# EAGLE design MJ514 - rev.1 - POC (EAGLE 9.6.2)
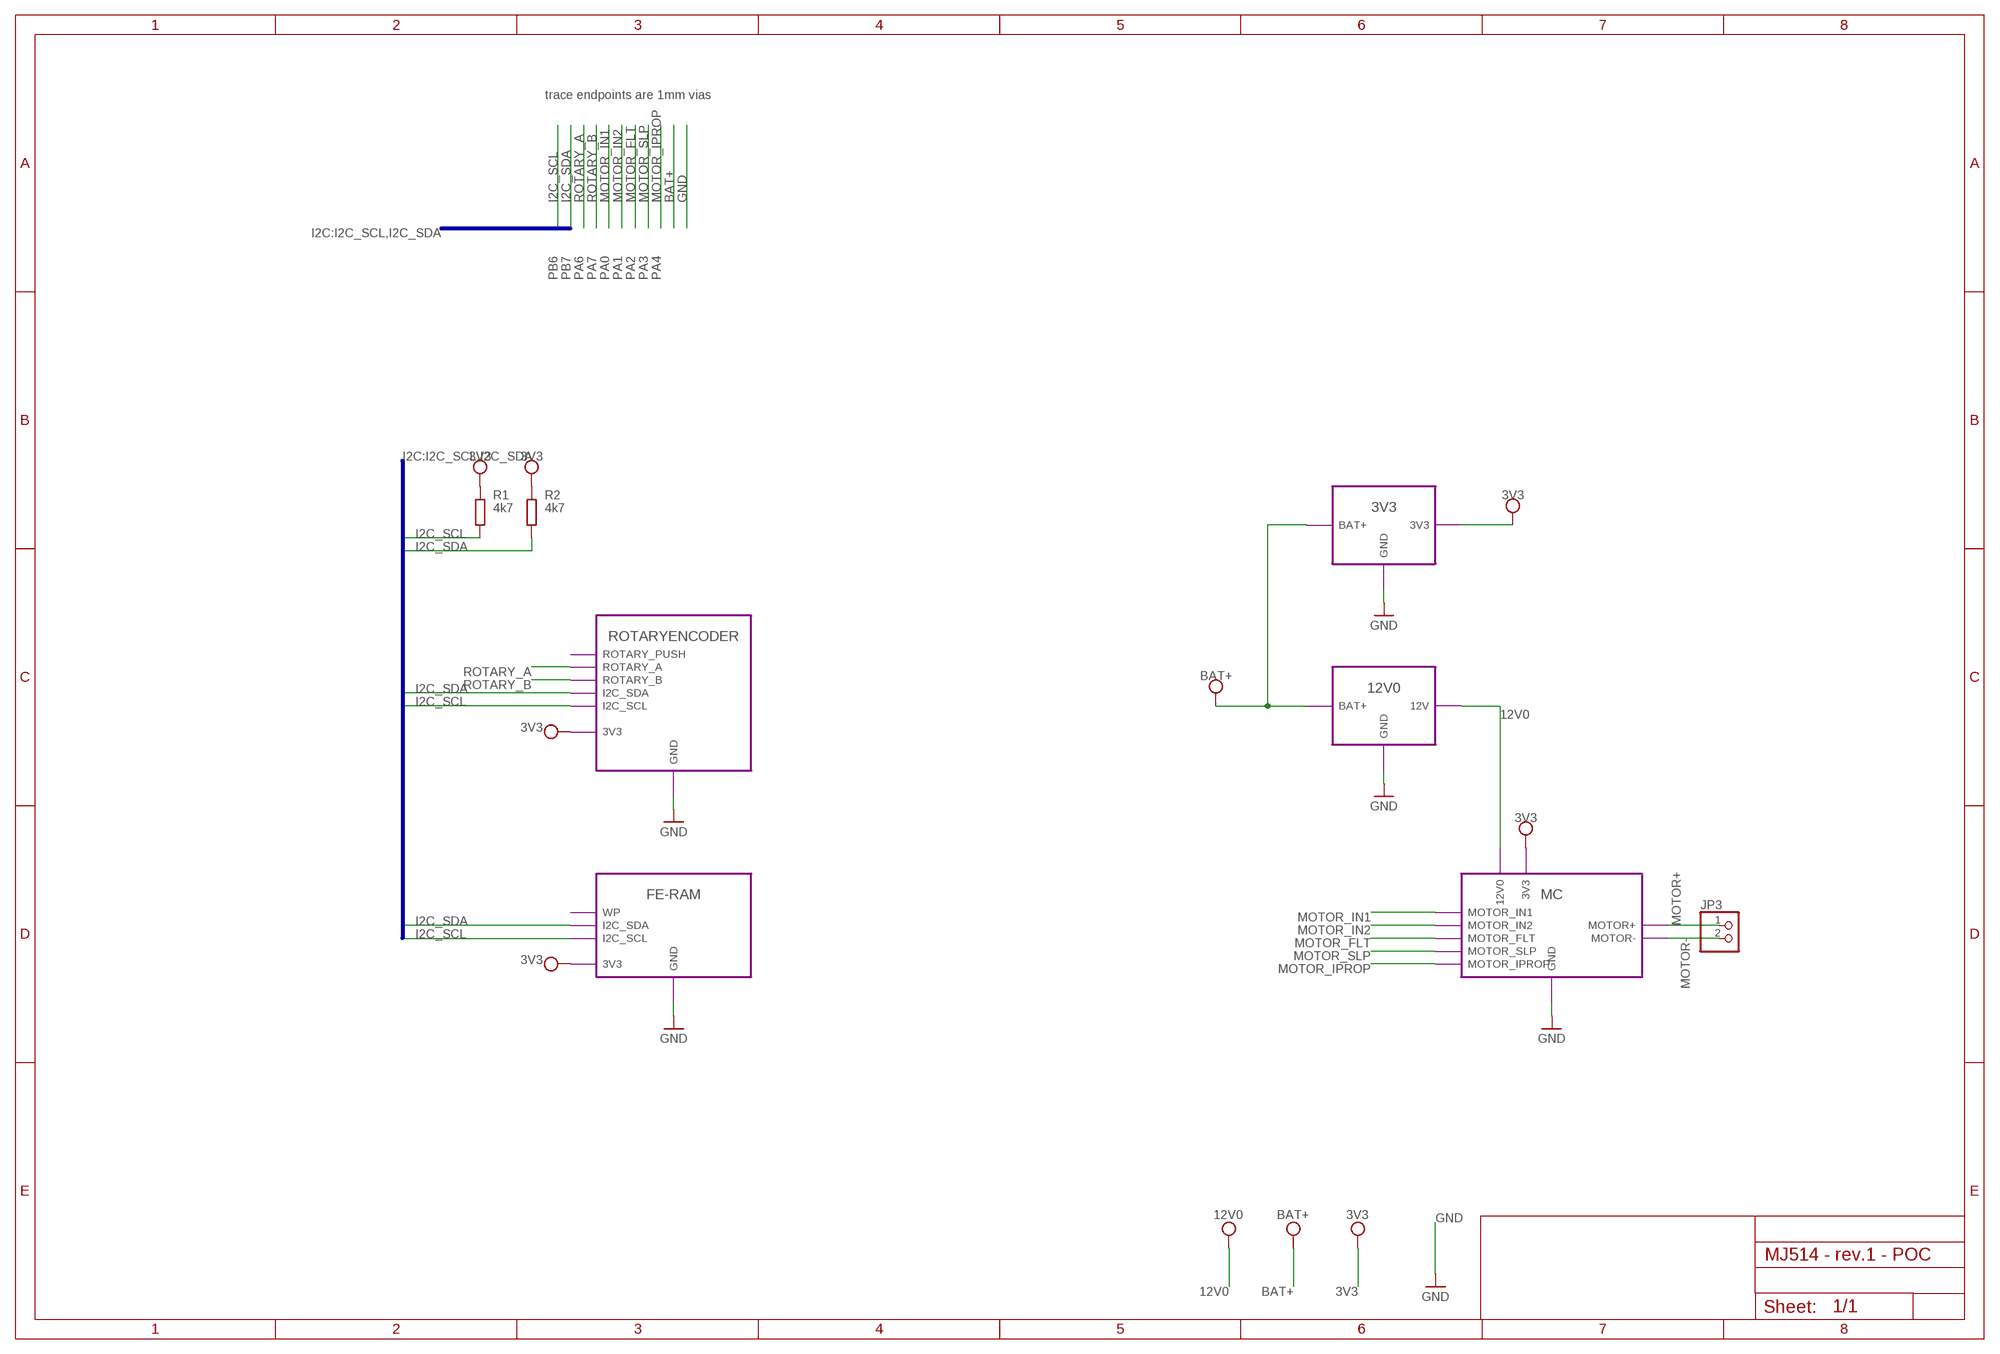
[diagram p0: schematic, sheet 1]

## Parts
JP3  PINHD-1X2  [1X02]
R1  4k7  R-EU_R0402  [R0402]
R2  4k7  R-EU_R0402  [R0402]

## Module instances
ROTARYENCODER = ROTARYENCODER (part numbers offset by 900)
FE-RAM = FE-RAM (part numbers offset by 700)
12V0 = 12V0 (part numbers offset by 800)
MC = MOTOR_CONTROLLER (part numbers offset by 1000)
3V3 = 3V3 (part numbers offset by 200)

## Nets
3V3 [3V3]: R1.2 R2.2 ; port ROTARYENCODER.3V3 FE-RAM.3V3 MC.3V3 3V3.3V3
12V0 [12V0]: port 12V0.12V MC.12V0
BAT+ [BAT+]: port 12V0.BAT+ 3V3.BAT+
GND: port FE-RAM.GND ROTARYENCODER.GND 12V0.GND MC.GND 3V3.GND
I2C_SCL [signal]: R1.1 ; port FE-RAM.I2C_SCL ROTARYENCODER.I2C_SCL
I2C_SDA [signal]: R2.1 ; port FE-RAM.I2C_SDA ROTARYENCODER.I2C_SDA
MOTOR+ [signal]: JP3.1 ; port MC.MOTOR+
MOTOR- [signal]: JP3.2 ; port MC.MOTOR-
MOTOR_FLT [signal]: port MC.MOTOR_FLT
MOTOR_IN1 [signal]: port MC.MOTOR_IN1
MOTOR_IN2 [signal]: port MC.MOTOR_IN2
MOTOR_IPROP [signal]: port MC.MOTOR_IPROP
MOTOR_SLP [signal]: port MC.MOTOR_SLP
ROTARY_A [signal]: port ROTARYENCODER.ROTARY_A
ROTARY_B [signal]: port ROTARYENCODER.ROTARY_B

## Buses
I2C:I2C_SCL,I2C_SDA

## Notes on the sheet
- trace endpoints are 1mm vias
- PB6 | PB7 | PA6 | PA7 | PA0 | PA1 | PA2 | PA3 | PA4

## Library data of the parts
JP3 = pinhead:PINHD-1X2: PIN HEADER
R1 R2 = rcl:R-EU_: RESISTOR, European symbol; SPICEPREFIX: R

## Module ROTARYENCODER
Ports: GND(pwr) 3V3(pwr) I2C_SCL(in) I2C_SDA(io) ROTARY_B(out) ROTARY_A(out) ROTARY_PUSH(out)
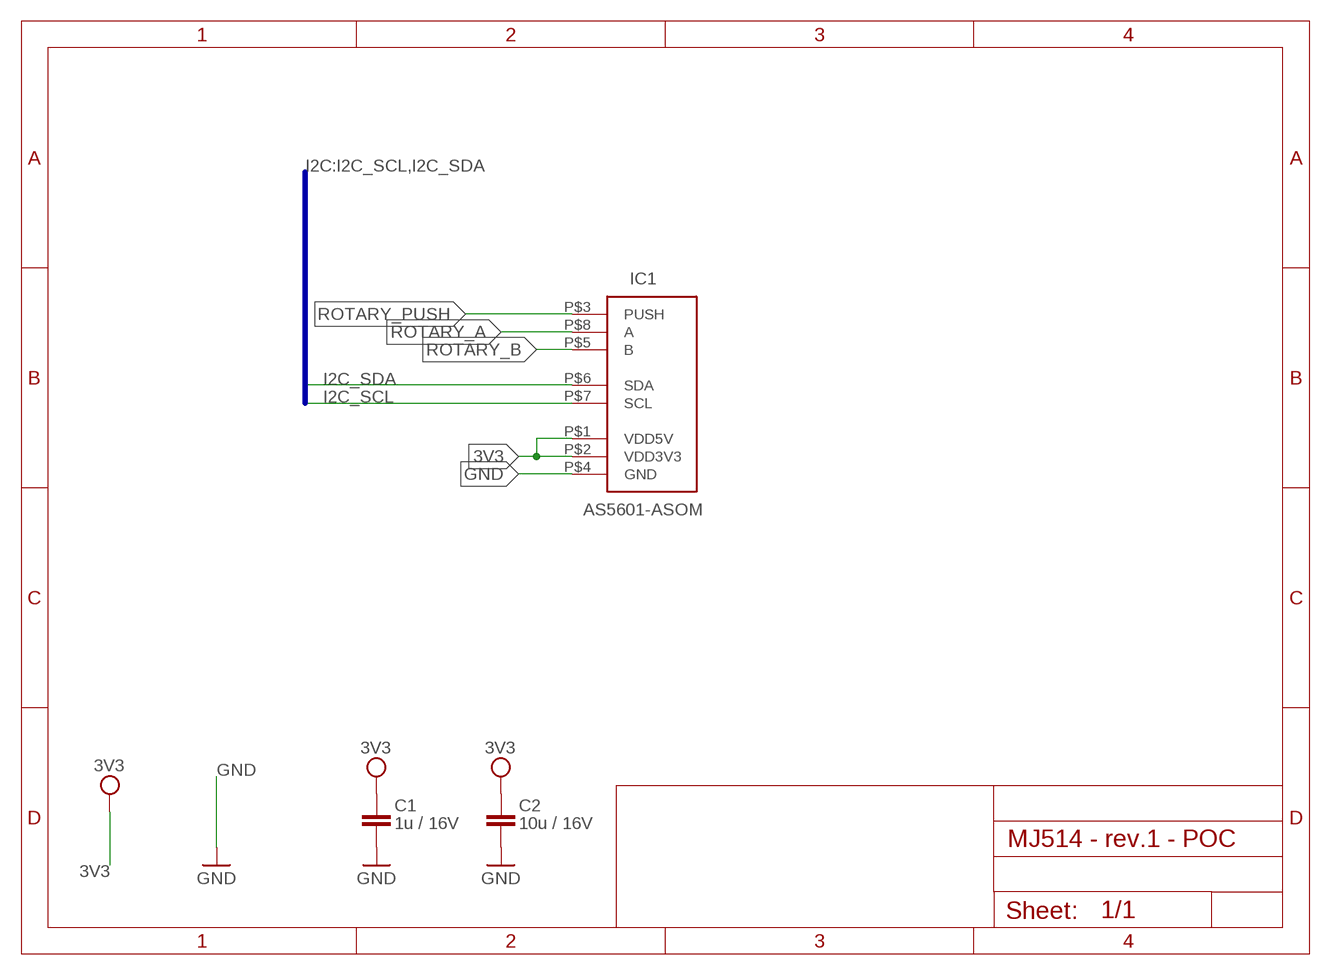
[diagram p1: schematic, module ROTARYENCODER, sheet 1]

### Parts
C1  1u / 16V  C-EUC0402  [C0402]
C2  10u / 16V  C-EUC0402  [C0402]
IC1  AS5601-ASOM  AS5601  [SOIC8]

### Nets
3V3: C1.1 C2.1 IC1.P$1(VDD5V) IC1.P$2(VDD3V3)
GND: C1.2 C2.2 IC1.P$4(GND)
I2C_SCL: IC1.P$7(SCL)
I2C_SDA: IC1.P$6(SDA)
ROTARY_A: IC1.P$8(A)
ROTARY_B: IC1.P$5(B)
ROTARY_PUSH: IC1.P$3(PUSH)

### Buses
I2C:I2C_SCL,I2C_SDA

### Library data of the parts
C1 C2 = rcl:C-EU: CAPACITOR, European symbol; SPICEPREFIX: C
IC1 = AS5601 - Programmable Contactless Encoder:AS5601

## Module FE-RAM
Ports: GND(pwr) 3V3(pwr) I2C_SCL(in) I2C_SDA(io) WP(hiz)
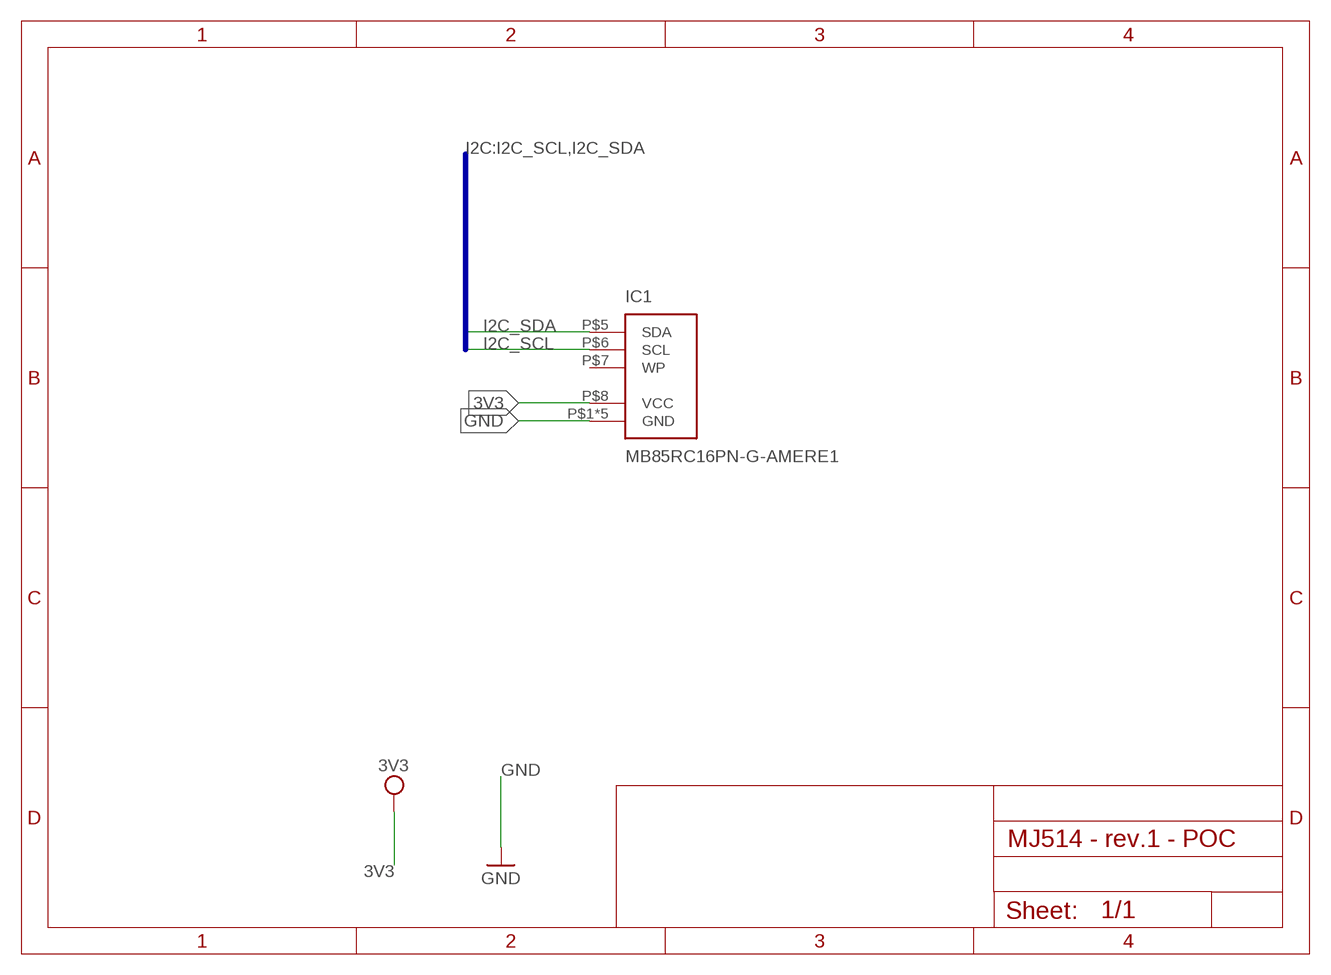
[diagram p2: schematic, module FE-RAM, sheet 1]

### Parts
IC1  MB85RC16PN-G-AMERE1  MB85RC  [SON-8]

### Nets
3V3: IC1.P$8(VCC)
GND: IC1.P$1(GND) IC1.P$2(GND) IC1.P$3(GND) IC1.P$4(GND) IC1.P$9(GND)
I2C_SCL: IC1.P$6(SCL)
I2C_SDA: IC1.P$5(SDA)
Unconnected: IC1.P$7(WP)

### Buses
I2C:I2C_SCL,I2C_SDA

### Library data of the parts
IC1 = MB85RC - FeRAM, I2C:MB85RC

## Module 12V0
Ports: GND(pwr) 12V(pwr) BAT+(pwr)
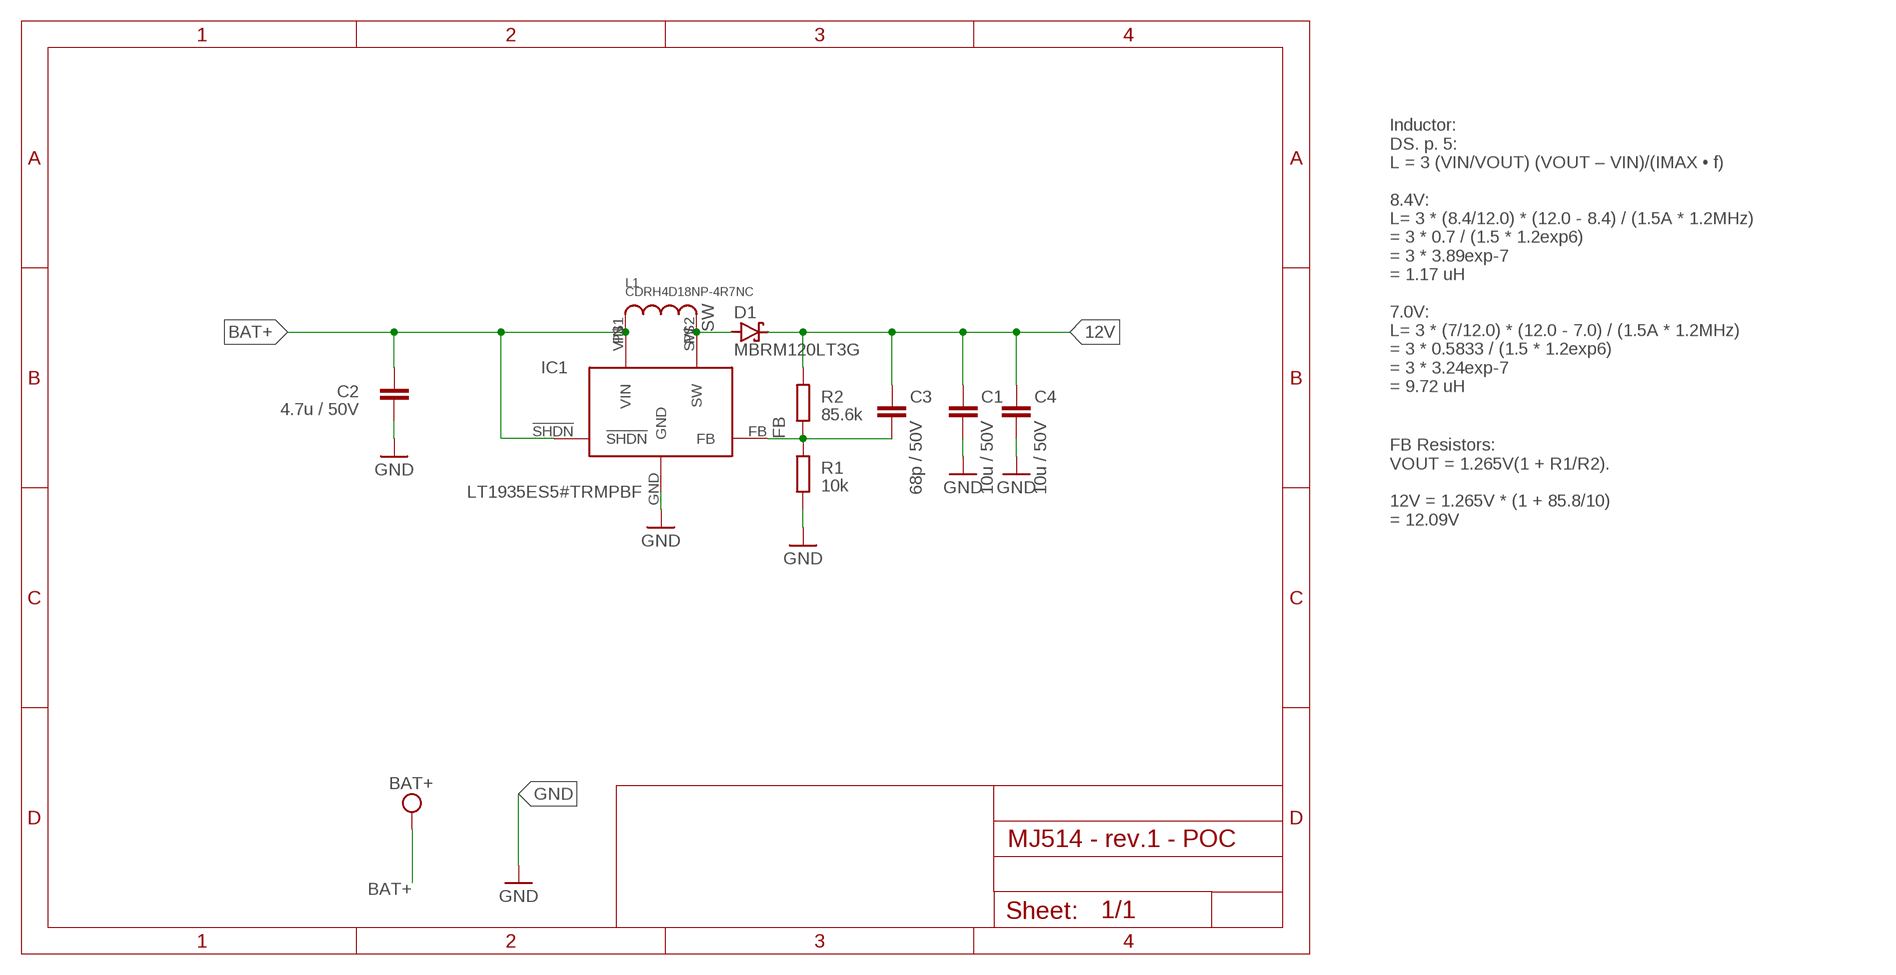
[diagram p3: schematic, module 12V0, sheet 1]

### Parts
C1  10u / 50V  C-EUC0402  [C0402]
C2  4.7u / 50V  C-EUC0805  [C0805]
C3  68p / 50V  C-EUC0402  [C0402]
C4  10u / 50V  C-EUC0402  [C0402]
D1  MBRM120LT3G  SCHOTTKY-DIODESMD  [SMB]
IC1  LT1935ES5#TRMPBF  LT1935  [TSOT-23-5]
L1  CDRH4D18NP-4R7NC  CDRH4D18  [5050]
R1  10k  R-EU_R0603  [R0603]
R2  85.6k  R-EU_R0603  [R0603]

### Nets
12V [12V0]: C1.1 C3.1 C4.1 D1.C R2.2
BAT+ [BAT+]: C2.2 IC1.!SHDN! IC1.VIN L1.P$1
FB [signal]: C3.2 IC1.FB R1.2 R2.1
GND: C1.2 C2.1 C4.2 IC1.GND R1.1
SW [12V0]: D1.A IC1.SW L1.P$2

### Notes on the sheet
- Inductor:
  DS. p. 5:
  L = 3 (VIN/VOUT) (VOUT – VIN)/(IMAX • f)
  
  8.4V:
  L= 3 * (8.4/12.0) * (12.0 - 8.4) / (1.5A * 1.2MHz)
  = 3 * 0.7 / (1.5 * 1.2exp6)
  = 3 * 3.89exp-7
  = 1.17 uH
  
  7.0V:
  L= 3 * (7/12.0) * (12.0 - 7.0) / (1.5A * 1.2MHz)
  = 3 * 0.5833 / (1.5 * 1.2exp6)
  = 3 * 3.24exp-7
  = 9.72 uH
- FB Resistors:
  VOUT = 1.265V(1 + R1/R2).
  
  12V = 1.265V * (1 + 85.8/10)
  = 12.09V

### Library data of the parts
C1-C4 = rcl:C-EU: CAPACITOR, European symbol; SPICEPREFIX: C
D1 = diode:SCHOTTKY-DIODE: Schottky Diode
IC1 = LTC1935 - Boost DC-DC Converter:LT1935
L1 = CDRH4D18 - Power Inductor:CDRH4D18
R1 R2 = rcl:R-EU_: RESISTOR, European symbol; SPICEPREFIX: R

## Module MOTOR_CONTROLLER
Ports: MOTOR+(out) MOTOR-(out) GND(pwr) 12V0(pwr) 3V3(pwr) MOTOR_IN1(in) MOTOR_IN2(in) MOTOR_FLT(out) MOTOR_SLP(in) MOTOR_IPROP(out)
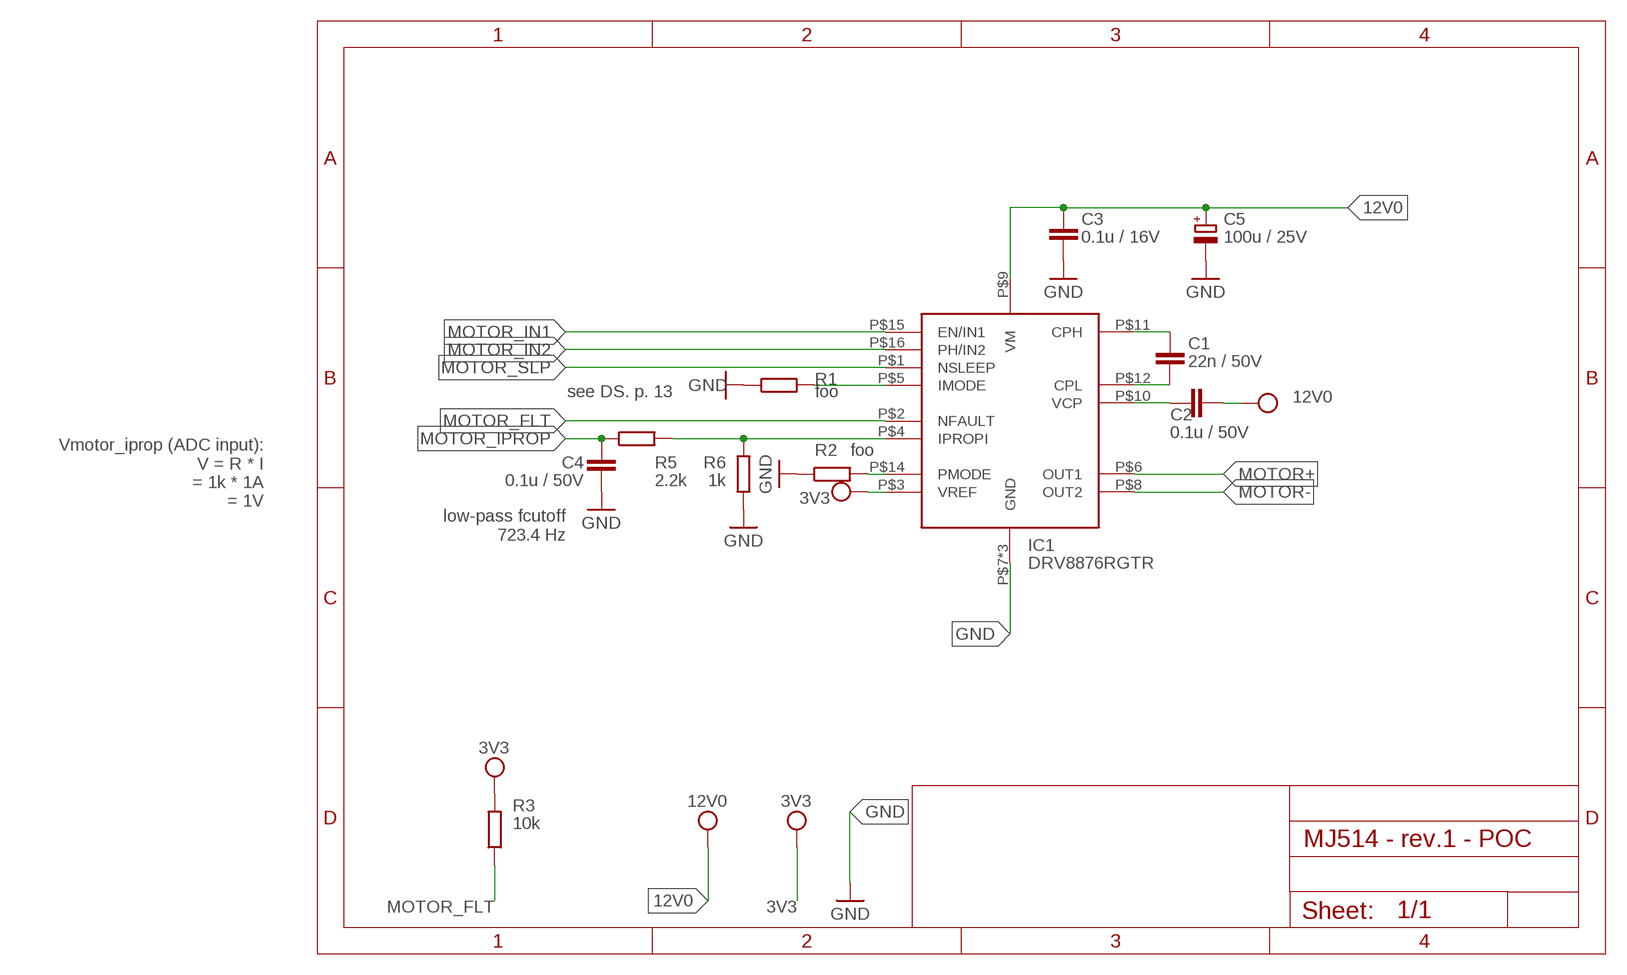
[diagram p4: schematic, module MOTOR_CONTROLLER, sheet 1]

### Parts
C1  22n / 50V  C-EUC0402  [C0402]
C2  0.1u / 50V  C-EUC0402  [C0402]
C3  0.1u / 16V  C-EUC0402  [C0402]
C4  0.1u / 50V  C-EUC0402  [C0402]
C5  100u / 25V  CPOL-EUE2.5-4V  [E2,5RE]
IC1  DRV8876RGTR  DRV8876  [VQFN16]
R1  foo  R-EU_R0402  [R0402]
R2  foo  R-EU_R0402  [R0402]
R3  10k  R-EU_R0402  [R0402]
R5  2.2k  R-EU_R0402  [R0402]
R6  1k  R-EU_R0402  [R0402]

### Nets
3V3 [signal]: IC1.P$3(VREF) R3.2
12V0 [12V0]: C2.2 C3.2 C5.+ IC1.P$9(VM)
CPH [signal]: C1.1 IC1.P$11(CPH)
CPL [signal]: C1.2 IC1.P$12(CPL)
GND: C3.1 C4.2 C5.- IC1.P$7(GND) IC1.P$13(GND) IC1.P$17(GND) R1.1 R2.1 R6.1
IMODE [signal]: IC1.P$5(IMODE) R1.2
IPROPI [signal]: IC1.P$4(IPROPI) R5.2 R6.2
MOTOR+ [signal]: IC1.P$6(OUT1)
MOTOR- [signal]: IC1.P$8(OUT2)
MOTOR_FLT [signal]: IC1.P$2(NFAULT) R3.1
MOTOR_IN1 [12V0]: IC1.P$15(EN/IN1)
MOTOR_IN2 [12V0]: IC1.P$16(PH/IN2)
MOTOR_IPROP [signal]: C4.1 R5.1
MOTOR_SLP [signal]: IC1.P$1(NSLEEP)
PMODE [signal]: IC1.P$14(PMODE) R2.2
VCP [signal]: C2.1 IC1.P$10(VCP)

### Notes on the sheet
- see DS. p. 13
- Vmotor_iprop (ADC input):
  V = R * I
  = 1k * 1A
  = 1V
- low-pass fcutoff
  723.4 Hz

### Library data of the parts
C1-C4 = rcl:C-EU: CAPACITOR, European symbol; SPICEPREFIX: C
C5 = rcl:CPOL-EU: POLARIZED CAPACITOR, European symbol; SPICEPREFIX: C
IC1 = DRV8876 - H-Bridge Motor Driver:DRV8876
R1-R3 R5 R6 = rcl:R-EU_: RESISTOR, European symbol; SPICEPREFIX: R

## Module 3V3
Ports: GND(pwr) BAT+(pwr) 3V3(pwr)
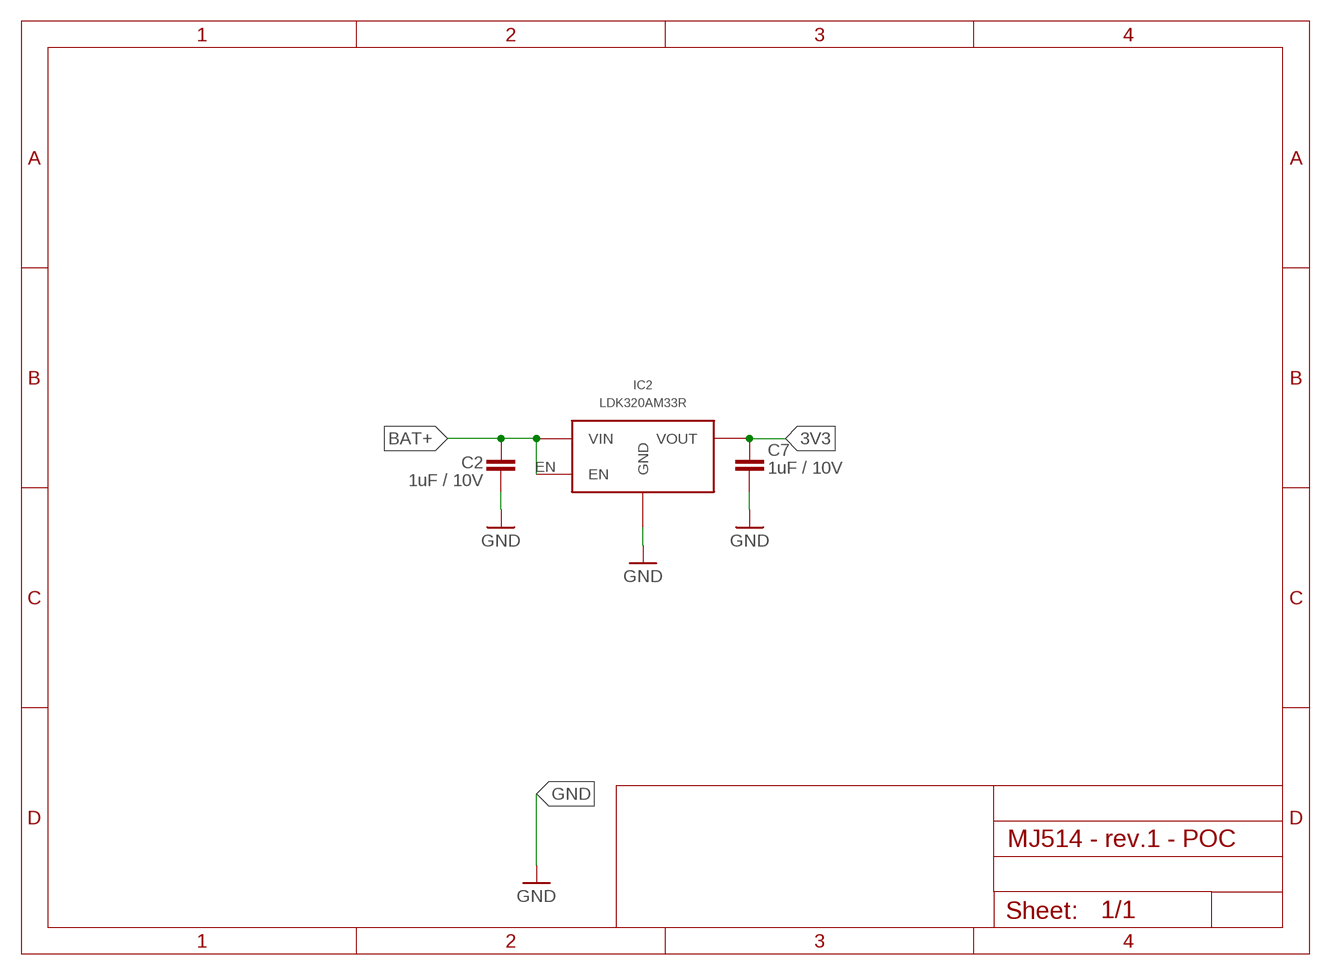
[diagram p5: schematic, module 3V3, sheet 1]

### Parts
C2  1uF / 10V  C-EUC0402  [C0402]
C7  1uF / 10V  C-EUC0402  [C0402]
IC2  LDK320AM33R  LDK320SOT-23-5L  [SOT-23-5L]

### Nets
3V3 [3V3]: C7.2 IC2.OUT(VOUT)
BAT+ [BAT+]: C2.1 IC2.EN IC2.IN(VIN)
GND: C2.2 C7.1 IC2.GND

### Library data of the parts
C2 C7 = rcl:C-EU: CAPACITOR, European symbol; SPICEPREFIX: C
IC2 = LDK320 5V LDO:LDK320

## Module HUMIDITY
Ports: GND(pwr) 3V3(pwr) SCL(in) SDA(io)
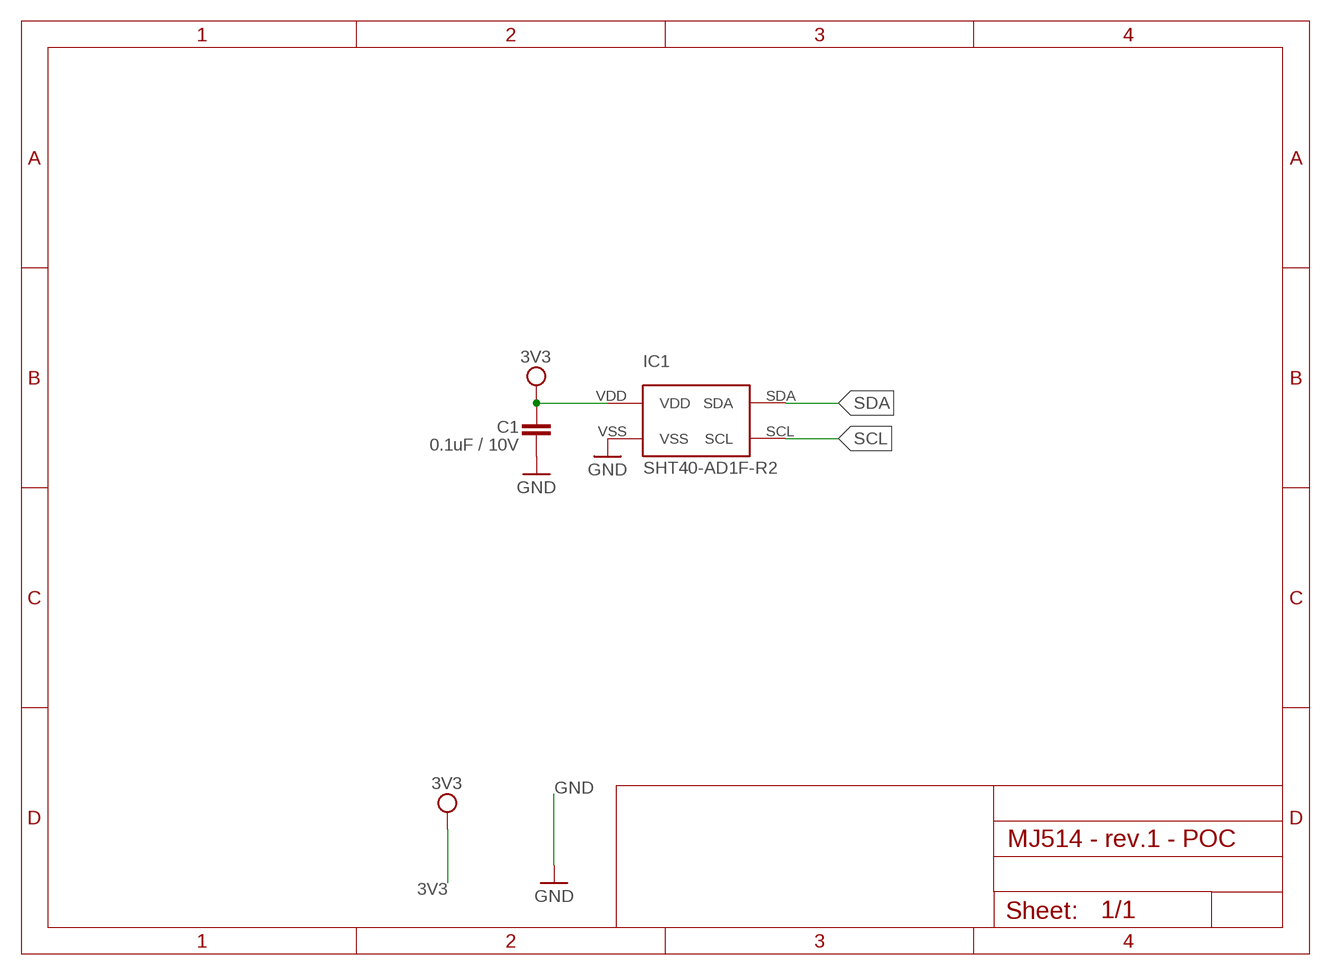
[diagram p6: schematic, module HUMIDITY, sheet 1]

### Parts
C1  0.1uF / 10V  C-EUC0402  [C0402]
IC1  SHT40-AD1F-R2  SHT40  [SMD]

### Nets
3V3 [3V3]: C1.1 IC1.VDD
GND: C1.2 IC1.VSS
SCL [signal]: IC1.SCL
SDA [signal]: IC1.SDA

### Library data of the parts
C1 = rcl:C-EU: CAPACITOR, European symbol; SPICEPREFIX: C
IC1 = SHT40-AD1F - Humidity Sensor:SHT40

## Net classes
0 GND: drill 0.35 mm, clearance 0.19 mm
1 BAT+: width 0.5 mm, drill 0.35 mm, clearance 0.19 mm
2 12V0: width 0.5 mm, drill 0.35 mm, clearance 0.19 mm
3 signal: width 0.25 mm, drill 0.35 mm, clearance 0.19 mm
4 3V3: width 0.25 mm, drill 0.35 mm, clearance 0.19 mm
5 motor: width 0.5 mm, drill 0.35 mm, clearance 0.19 mm

## Board
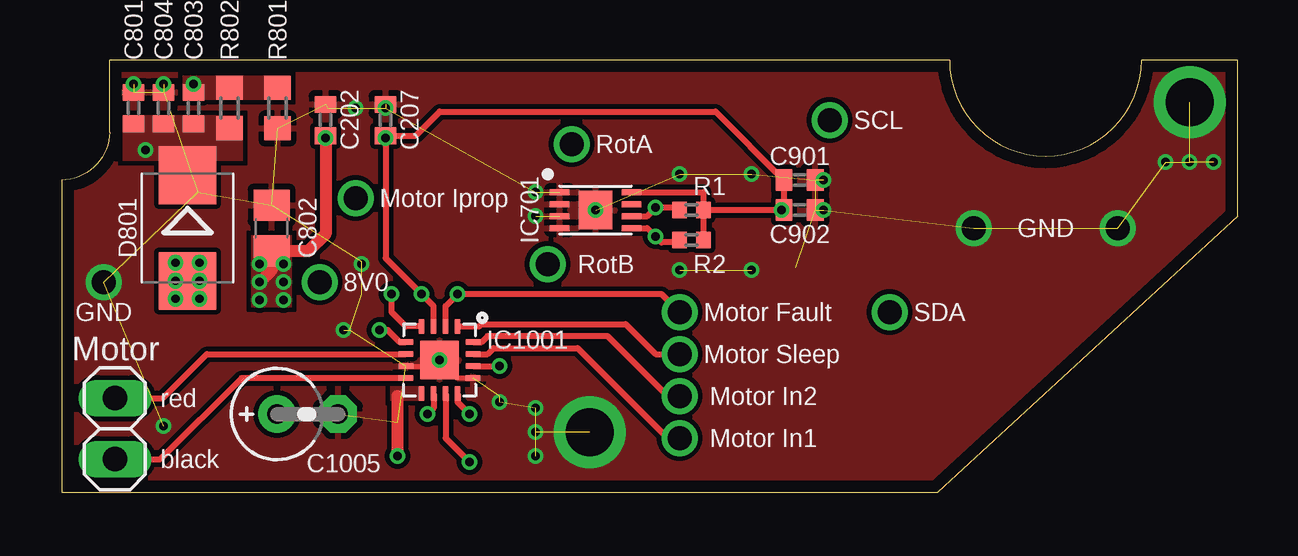
[diagram p7: board, top side]
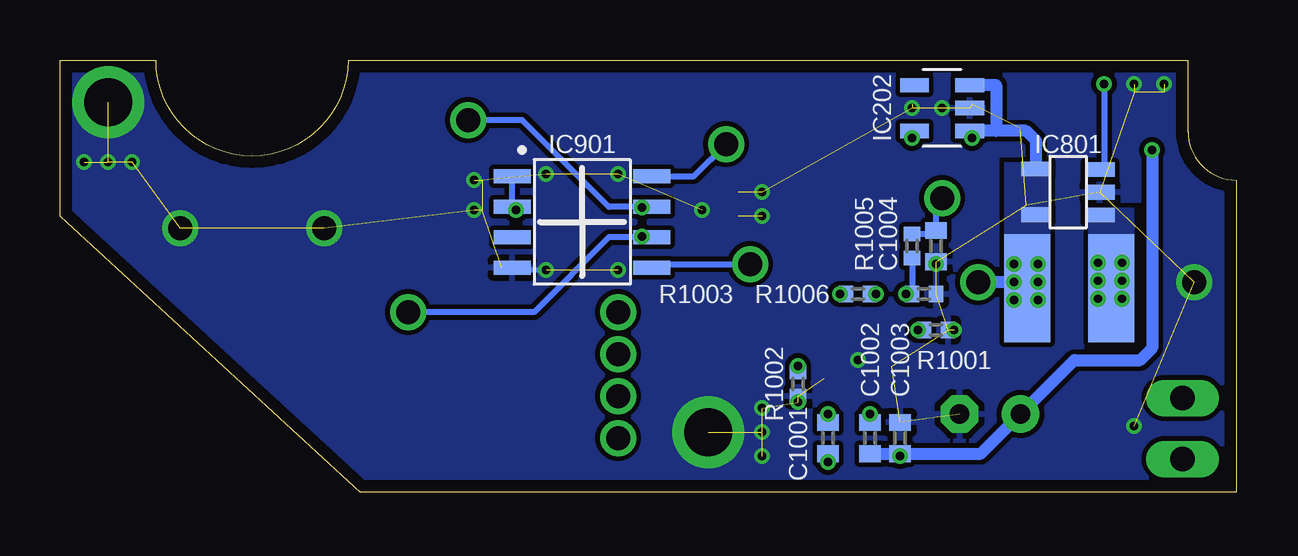
[diagram p8: board, bottom side, seen from below]

Size 49 x 18 mm. Coordinates in mm from the lower left corner, seen from the top.
Outline: 0,0 36.5,0 49,11.5 49,18 45,18 arc-180 37,18 2,18 2,15 arc-90 0,13 0,0
Copper layers (1*16): Top 0.035mm / dielectric 1.5mm / Bottom 0.035mm
Design rules "markovac_2layer": minimum track width 0.2mm, minimum drill 0.35mm, track to track 0.2mm, track to pad 0.2mm, pad to pad 0.2mm, via to via 0.2mm, smd to smd 0.2mm, copper to edge 0.5mm, drill to drill 8mil, minimum pad ring 0.15mm, minimum via ring 0.15mm, stop-mask expansion 4mil, vias tented up to drill 0.35mm, thermal gap 10mil

### Footprints (pad centres in the part's own frame; a part is rotated, then mirrored left to right if it is on the bottom)
C0402 = smd 0.7 x 0.9: 1 -0.65,0; 2 0.65,0
C0805 = smd 1.3 x 1.5: 1 -0.95,0; 2 0.95,0
E2,5RE = drill 0.813 pad 1.575: + -1.27,0 | drill 0.813 pad 1.575 octagon: - 1.27,0
SMB = smd 2.4 x 2.4: A 2.2,0; C -2.2,0
SOT-23-5L = smd 0.6 x 1.2: ADJ/NC -0.95,-1.15; EN -0.95,1.15; GND 0,1.15; IN 0.95,1.15; OUT 0.95,-1.15
SON-8 = smd 0.25 x 0.8: P$1 -0.75,-1.5; P$2 -0.25,-1.5; P$3 0.25,-1.5; P$4 0.75,-1.5; P$5 0.75,1.5; P$6 0.25,1.5; P$7 -0.25,1.5; P$8 -0.75,1.5 | smd 1.6 x 1.4: P$9 0,0
TSOT-23-5 = smd 0.62 x 1.22: !SHDN! 0.96,1.33; FB 0.94,-1.33; GND -0.01,-1.33; SW -0.96,-1.33; VIN -0.94,1.33
SOIC8 = smd 0.6 x 1.55: P$1 -1.905,-2.91; P$2 -0.635,-2.91; P$3 0.635,-2.91; P$4 1.905,-2.91; P$5 1.905,2.91; P$6 0.635,2.91; P$7 -0.635,2.91; P$8 -1.905,2.91
VQFN16 = smd 0.6 x 0.24: P$1 -1.4,0.75; P$2 -1.4,0.25; P$3 -1.4,-0.25; P$4 -1.4,-0.75; P$9 1.4,-0.75; P$10 1.4,-0.25; P$11 1.4,0.25; P$12 1.4,0.75 | smd 0.24 x 0.6: P$5 -0.75,-1.4; P$6 -0.25,-1.4; P$7 0.25,-1.4; P$8 0.75,-1.4; P$13 0.75,1.4; P$14 0.25,1.4; P$15 -0.25,1.4; P$16 -0.75,1.4 | smd 1.6 x 1.6: P$17 0,0
1X02 = drill 1.016 long: 1 -1.27,0; 2 1.27,0
5050 = smd 4.5 x 1.9: P$1 0,1.75; P$2 0,-1.75
R0402 = smd 0.6 x 0.7: 1 -0.5,0; 2 0.5,0
R0603 = smd 1 x 1.1: 1 -0.85,0; 2 0.85,0

### Placement (x,y rotation side)
C202  1uF / 10V  [C0402]  11,15.5 90 top
C207  1uF / 10V  [C0402]  13.5,15.5 270 top
C801  10u / 50V  [C0402]  3,16 90 top
C802  4.7u / 50V  [C0805]  8.75,11 270 top
C803  68p / 50V  [C0402]  5.5,16 90 top
C804  10u / 50V  [C0402]  4.25,16 90 top
C901  1u / 16V  [C0402]  30.75,13 0 top
C902  10u / 16V  [C0402]  30.75,11.75 0 top
C1001  22n / 50V  [C0402]  17,2.25 90 bottom
C1002  0.1u / 50V  [C0402]  15.25,2.25 270 bottom
C1003  0.1u / 16V  [C0402]  14,2.25 270 bottom
C1004  0.1u / 50V  [C0402]  12.5,10.25 270 bottom
C1005  100u / 25V  [E2,5RE]  10.25,3.25 0 top
D801  MBRM120LT3G  [SMB]  5.25,11 270 top
IC202  LDK320AM33R  [SOT-23-5L]  12.25,16 270 bottom
IC701  MB85RC16PN-G-AMERE1  [SON-8]  22.25,11.75 270 top
IC801  LT1935ES5#TRMPBF  [TSOT-23-5]  7,12.5 90 bottom
IC901  AS5601-ASOM  [SOIC8]  27.25,11.25 270 bottom
IC1001  DRV8876RGTR  [VQFN16]  15.75,5.5 270 top
JP3  2.22,2.64 270 top
L801  CDRH4D18NP-4R7NC  [5050]  6.95,8.5 90 bottom
R1  26.25,11.75 0 top
R2  26.25,10.5 0 top
R801  10k  [R0603]  9,16 90 top
R802  85.6k  [R0603]  7,16 270 top
R1001  foo  [R0402]  12.5,6.75 180 bottom
R1002  foo  [R0402]  18.25,4.5 90 bottom
R1003  10k  [R0402]  15.75,8.25 0 bottom
R1005  2.2k  [R0402]  13.5,10.25 270 bottom
R1006  1k  [R0402]  13,8.25 180 bottom

### Tracks (layer width: path | path; a pad name or v marks a point on that pad's centre or on a via)
3V3  (via drill 0.35)
  Top 0.25: IC701.P$8 26.75,12.5 R1.2 | R2.2 R1.2 | C902.1 C901.1 27.25,15.85 15.75,15.85 14.75,14.85 C207.2 | C902.1 v30,11.75 | C902.1 R1.2 | IC1001.P$3 15.5,7.75 v15,8.25 13.5,9.75 C207.2 | C207.2 v13.5,14.75
  Bottom 0.25: IC901.P$1 IC901.P$2 30.02,11.75 v30,11.75 | v15,8.25 R1003.2 | IC202.OUT 13.5,14.95 v13.5,14.75
12V0  (via drill 0.35)
  Top 0.5: v14,1.5 14,4
  Bottom 0.5: C1002.2 C1003.2 | C1003.2 10.63,1.6 C1005.+ 6.73,5.5 4,5.5 3.5,6 v3.5,14.25 | C1003.2 v14,1.5
  pour Top (no thermals): 2.55,15.7 2.55,13.8 7.55,13.8 7.55,15.7
  pour Top (no thermals): 15.1,4.4 13.7,4.4 13.7,3.8 15.1,3.8
12V0:FB  (via drill 0.35)
  Bottom 0.25: v5.5,17 5.5,13.61 IC801.FB
  pour Top (no thermals): 5.05,17.35 5.05,16.35 9.55,16.35 9.55,17.35
12V0:SW  (via drill 0.35)
  Top 0.5: D801.A 5.25,9.55 v4.75,9.55
  Bottom 0.5: L801.P$2 v4.75,8.05 | L801.P$2 5.2,8.8 v4.75,8.8 | L801.P$2 5.2,9.55 v4.75,9.55 | L801.P$2 5.75,8.5 v5.75,8.05 | L801.P$2 5.2,9 v5.75,9.55 | L801.P$2 5.5,8.8 v5.75,8.8
  pour Bottom (no thermals): 4.25,10.7 4.25,11.85 6.15,11.85 6.15,10.7
BAT+  (via drill 0.35, 1)
  Top 0.5: v8.25,8.75 8.75,9.25 C802.2 10.3,10.05 11,10.75 C202.1 v11,14.75
  Bottom 0.5: L801.P$1 8.95,8.75 v10.75,8.75 | IC202.EN 10,16.95 10,15.05 | IC801.!SHDN! 8.33,14.63 8.75,15.05 10,15.05 | v11,14.75 11.1,14.85 IC202.IN 10,15.05
  other vias: 8.25,9.5 9.25,9.5 9.25,8.75 8.25,8 9.25,8
  pour Bottom (no thermals): 7.75,10.7 7.75,13.75 9.65,13.75 9.65,10.7
  pour Top (no thermals): 9.6,10.7 7.9,10.7 7.9,7.7 9.6,7.7
GND  (via drill 0.35, 1, 2)  (44 unrouted)
  Top 0.2: IC1001.P$7 15.5,5.25 IC1001.P$17 16.5,4.75 IC1001.P$13
  Bottom 0.2: 30.59,9.35 IC901.P$4 30.07,9.25 v28.75,9.25
  other vias: 22,2.5 47,16.25 13.5,16 3,17 4.25,17 1.75,8.75 47,13.75 48,13.75 46,13.75 19.75,2.5 19.75,1.5 19.75,3.5 15.75,5.5 11.75,6.75 12.5,9.5 12.25,16 4.25,2.75 18.25,3.75 22.25,11.75 31.75,13 31.75,11.75 19.75,12.5 19.75,11.5 38,11 44,11 28.75,13.25 25.75,13.25 25.75,9.25
  pour Top (rank 6): -1,-1 50,-1 50,19 -1,19
  pour Bottom (rank 6): -1,-1 50,-1 50,19 -1,19
I2C_SCL  (via drill 0.35, 1)
  Top 0.25: IC701.P$6 24.4,11.5 v24.75,11.85 25.65,11.85 R1.1
  Bottom 0.25: v24.75,11.85 24.38,11.85 IC901.P$7 26.14,11.88 29.75,15.5 v32,15.5
I2C_SDA  (via drill 0.35, 1)
  Top 0.25: IC701.P$5 24.4,11 v24.75,10.65 25,10.4 25.65,10.4 R2.1
  Bottom 0.25: v24.75,10.65 24.71,10.62 IC901.P$6 26.14,10.62 29.25,7.5 v34.5,7.5
MC:CPH  (via drill 0.35)
  Top 0.25: IC1001.P$11 16,2.25 v17,1.25
  Bottom 0.25: C1001.1 v17,1.25
MC:CPL  (via drill 0.35)
  Top 0.25: IC1001.P$12 16.5,3.75 v17,3.25
  Bottom 0.25: C1001.2 v17,3.25
MC:IMODE  (via drill 0.35)
  Top 0.25: IC1001.P$5 14.1,6.25 13.6,6.75 v13.25,6.75
  Bottom 0.25: v13.25,6.75 R1001.2
MC:IPROPI  (via drill 0.35)
  Top 0.25: IC1001.P$4 14.35,6.9 13.75,7.5 v13.75,8.25
  Bottom 0.25: R1005.2 R1006.2 v13.75,8.25
MC:PMODE  (via drill 0.35)
  Top 0.25: IC1001.P$14 v18.25,5.25
  Bottom 0.25: R1002.2 v18.25,5.25
MC:VCP  (via drill 0.35)
  Top 0.25: IC1001.P$10 15.5,3.5 v15.25,3.25
  Bottom 0.25: C1002.1 v15.25,3.25
MOTOR+
  Top 0.25: JP3.1 4.22,3.91 6.06,5.75 IC1001.P$6
MOTOR-
  Top 0.25: IC1001.P$8 7.5,4.75 4.12,1.37 JP3.2
MOTOR_FLT  (via drill 0.35, 1)
  Top 0.25: IC1001.P$2 16,7.75 v16.5,8.25 25,8.25 v25.75,7.5
  Bottom 0.25: v16.5,8.25 R1003.1
MOTOR_IN1  (via drill 1)
  Top 0.25: v25.75,2.25 25.25,2.25 21.5,6 18,6 17.75,5.75 IC1001.P$15
MOTOR_IN2  (via drill 1)
  Top 0.25: IC1001.P$16 17.5,6.25 17.75,6.5 22.75,6.5 25.25,4 v25.75,4
MOTOR_IPROP  (via drill 1)
  Bottom 0.25: R1005.1 12.65,10.75 C1004.1 12.5,12 v12.25,12.25
MOTOR_SLP  (via drill 1)
  Top 0.25: IC1001.P$1 17.4,6.9 17.5,7 23.5,7 24.75,5.75 v25.75,5.75
ROTARY_A  (via drill 1)
  Bottom 0.25: IC901.P$8 22.59,13.15 v21.25,14.5
ROTARY_B  (via drill 1)
  Bottom 0.25: IC901.P$5 24.18,9.5 v20.25,9.5

### Text on the board
tPlace: SCL | RotA | Motor Iprop | GND | RotB | 8V0 | GND | Motor Fault | SDA | Motor | Motor Sleep | red | Motor In2 | Motor In1 | black
tStop: MJ514 POC / ejovrh rev.1a